# Altium schematic sheet ADC.SchDoc: ADC
size A3; Author: M.Beldyga; CompanyName: WUT ISE; DrawnBy: M.Beldyga; Organization: WUT ISE; Address1: PW ISE; Address2: Nowowiejska 15/19 00-665 Warsaw; Address3: micbeldyga@gmail.com; SheetNumber: 3; SheetTotal: 4; ModifiedBy: -; CheckedDate: -; Title2: MODULIQ; DivGrp: WUT ISE; Designer: M.Beldyga; ModifiedDate: -; ProjectName: Sensor Box
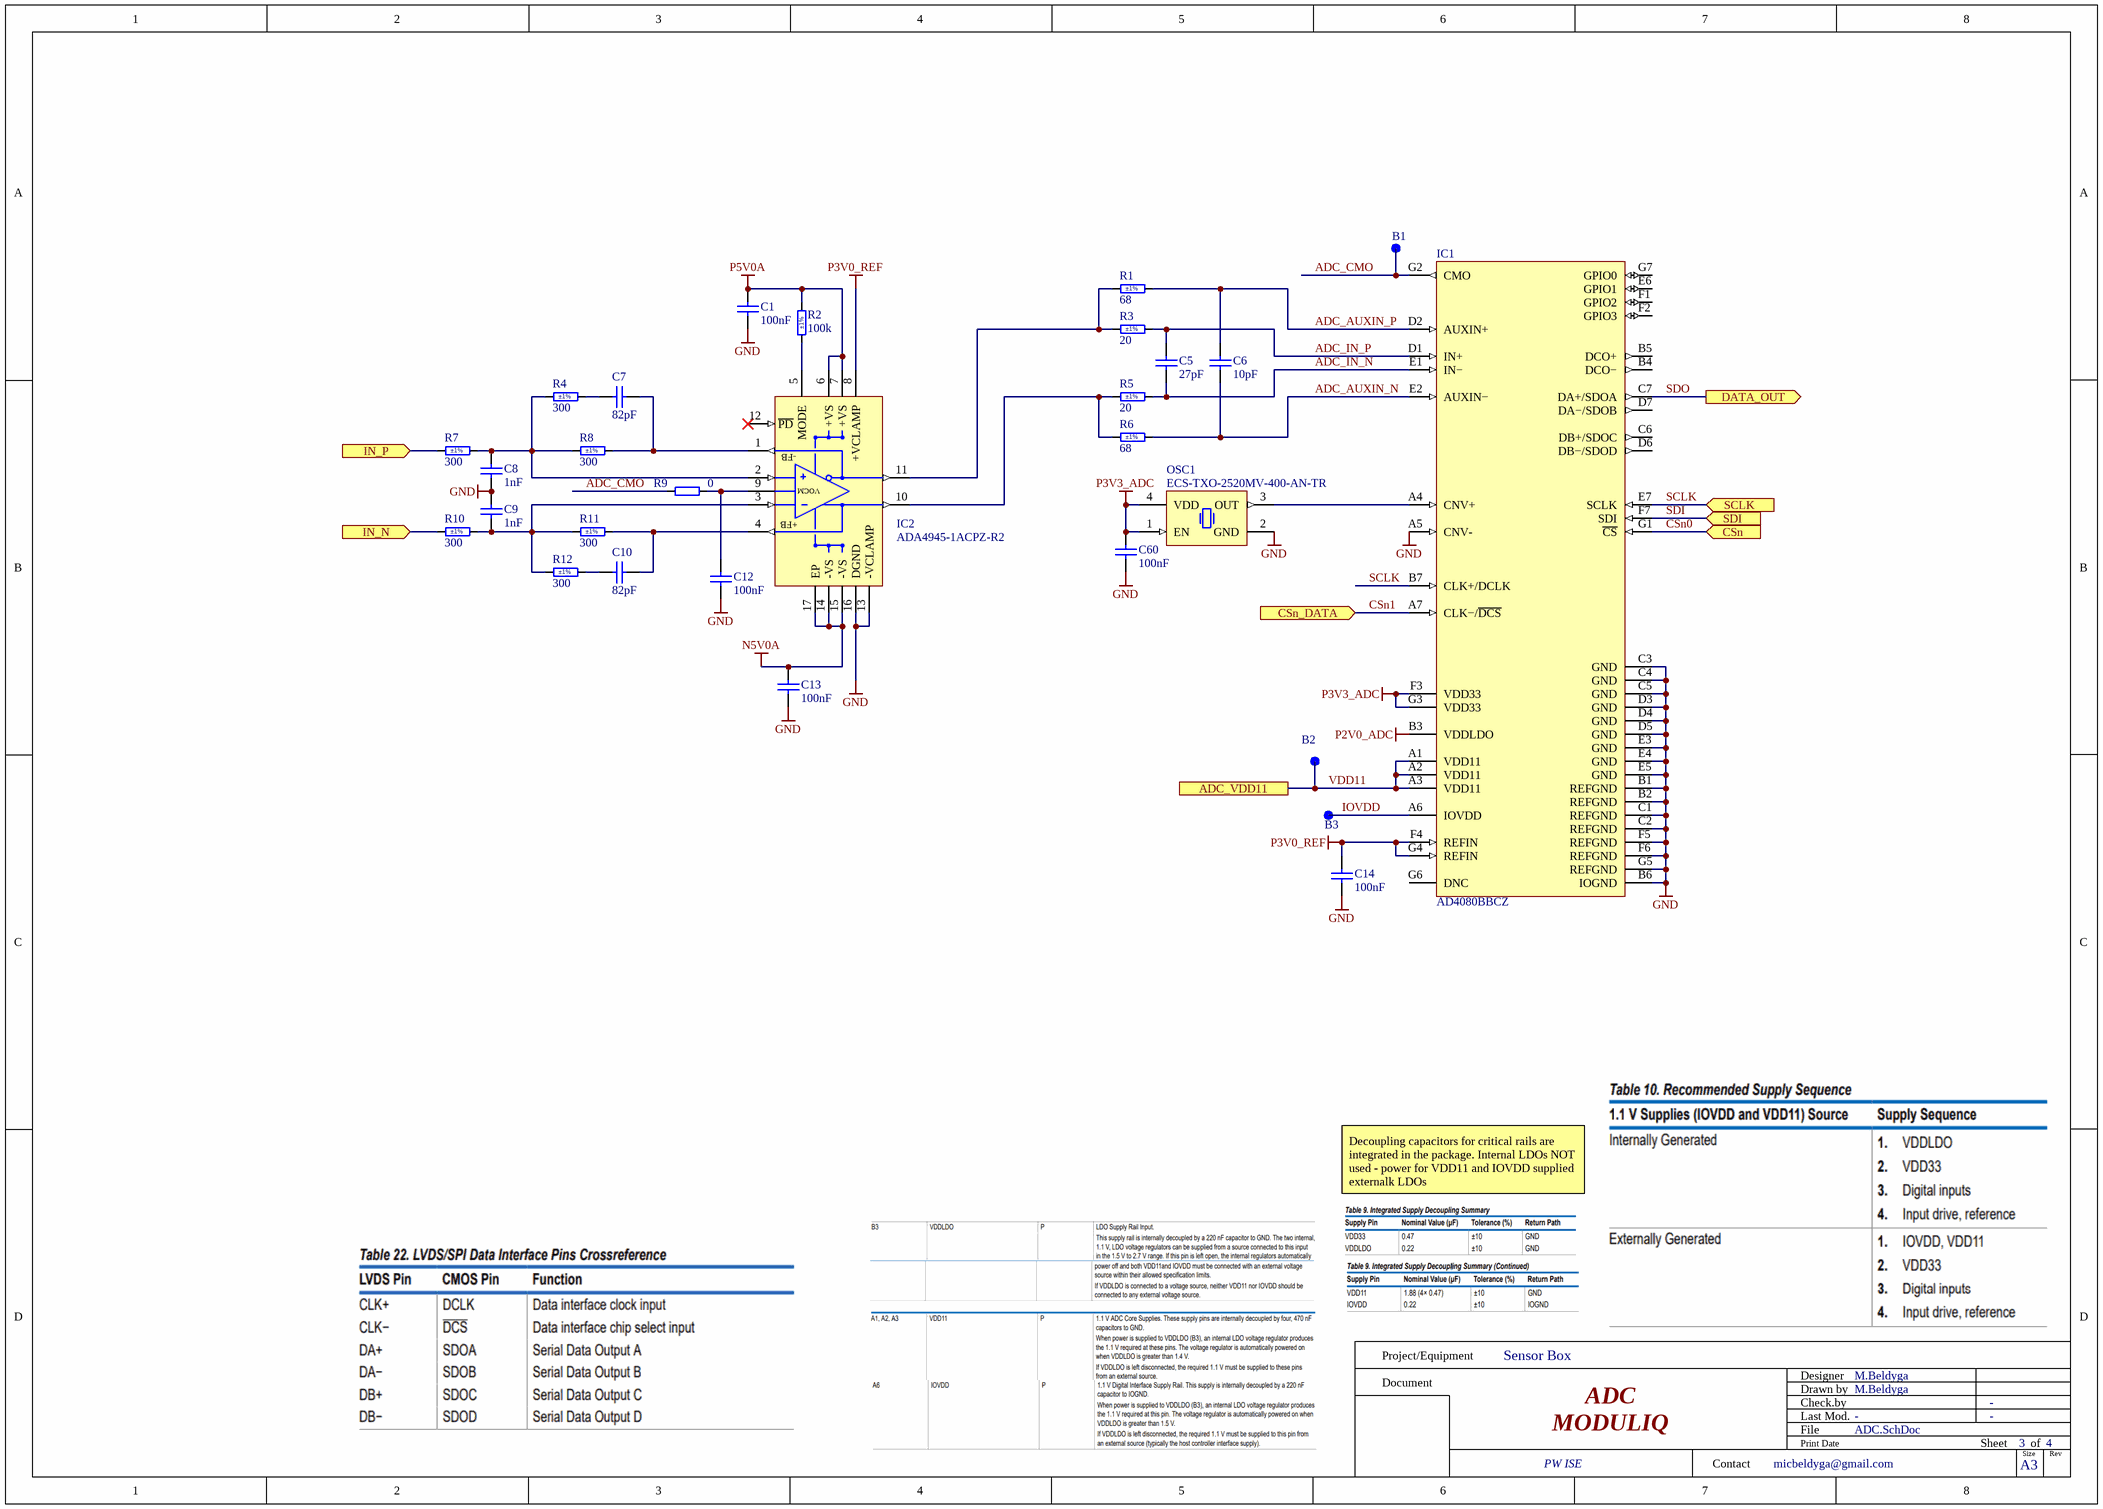
[diagram p0: ADC.SchDoc]

## Parts
B1  SMD Pad  [C100]  (value not drawn)  (no BOM)
B2  SMD Pad  [C100]  (value not drawn)  (no BOM)
B3  SMD Pad  [C100]  (value not drawn)  (no BOM)
C1  100nF  [CAPC1005X55N]
C5  27pF  [CAPC1005X55N]
C6  10pF  [CAPC1005X55N]
C7  82pF  [CAPC1005X55N]
C8  1nF  [CAPC1005X55N]
C9  1nF  [CAPC1005X55N]
C10  82pF  [CAPC1005X55N]
C12  100nF  [CAPC1005X55N]
C13  100nF  [CAPC1005X55N]
C14  100nF  [CAPC1005X55N]
C60  100nF  [CAPC1005X55N]
IC1  AD4080BBCZ  [BGA49C65P7X7_500X500X138]
IC2  ADA4945-1ACPZ-R2  [QFN50P300X300X80_HS-17N]
OSC1  ECS-TXO-2520MV-400-AN-TR  [OSC_QANTEK_QX2]
R1  68  Tolerance: ±1%  [RESC1005X40N]
R2  100k  Tolerance: ±1%  [RESC1005X40N]
R3  20  Tolerance: ±1%  [RESC1005X40N]
R4  300  Tolerance: ±1%  [RESC1005X40N]
R5  20  Tolerance: ±1%  [RESC1005X40N]
R6  68  Tolerance: ±1%  [RESC1005X40N]
R7  300  Tolerance: ±1%  [RESC1005X40N]
R8  300  Tolerance: ±1%  [RESC1005X40N]
R9  0  [RESC1005X40N]
R10  300  Tolerance: ±1%  [RESC1005X40N]
R11  300  Tolerance: ±1%  [RESC1005X40N]
R12  300  Tolerance: ±1%  [RESC1005X40N]

## Ports
ADC_VDD11, CSn (in), CSn_DATA (in), DATA_OUT (out), IN_N (in), IN_P (in), SCLK (in), SDI (in)

## Nets
GND: C1.1 C8.1 C9.2 C12.1 C13.1 C14.1 C60.1 IC1.A5(CNV-) IC1.B1(REFGND) IC1.B2(REFGND) IC1.B6(IOGND) IC1.C1(REFGND) IC1.C2(REFGND) IC1.C3(GND) IC1.C4(GND) IC1.C5(GND) IC1.D3(GND) IC1.D4(GND) IC1.D5(GND) IC1.E3(GND) IC1.E4(GND) IC1.E5(GND) IC1.F5(REFGND) IC1.F6(REFGND) IC1.G5(REFGND) IC2.13(-VCLAMP) IC2.16(DGND) OSC1.2(GND)
N5V0A: C13.2 IC2.14(-VS) IC2.15(-VS) IC2.17(EP)
P2V0_ADC: IC1.B3(VDDLDO)
P3V0_REF: C14.2 IC1.F4(REFIN) IC1.G4(REFIN) IC2.8(+VCLAMP)
P3V3_ADC: C60.2 IC1.F3(VDD33) IC1.G3(VDD33) OSC1.1(EN) OSC1.4(VDD)
P5V0A: C1.2 IC2.6(+VS) IC2.7(+VS) R2.2
ADC_AUXIN_N: C6.1 IC1.E2(AUXIN−) R6.2
ADC_AUXIN_P: C6.2 IC1.D2(AUXIN+) R1.2
ADC_CMO: B1.1 IC1.G2(CMO) R9.1
ADC_IN_N: C5.1 IC1.E1(IN−) R5.2
ADC_IN_P: C5.2 IC1.D1(IN+) R3.2
CSn0: IC1.G1(~{CS}) ; port CSn
CSn1: IC1.A7(CLK−/~{DCS}) ; port CSn_DATA
IN_N: R10.1 ; port IN_N
IN_P: R7.1 ; port IN_P
IOVDD: B3.1 IC1.A6(IOVDD)
SCLK: IC1.B7(CLK+/DCLK) IC1.E7(SCLK) ; port SCLK
SDI: IC1.F7(SDI) ; port SDI
SDO: IC1.C7(DA+/SDOA) ; port DATA_OUT
VDD11: B2.1 IC1.A1(VDD11) IC1.A2(VDD11) IC1.A3(VDD11) ; port ADC_VDD11
NetC7_1: C7.1 R4.2
NetC7_2: C7.2 IC2.1(-FB) R8.2
NetC8_2: C8.2 IC2.2(+IN) R4.1 R7.2 R8.1
NetC9_1: C9.1 IC2.3(-IN) R10.2 R11.1 R12.1
NetC10_1: C10.1 R12.2
NetC10_2: C10.2 IC2.4(+FB) R11.2
NetC12_2: C12.2 IC2.9(VOCM) R9.2
NetIC1_A4: IC1.A4(CNV+) OSC1.3(OUT)
NetIC2_5: IC2.5(MODE) R2.1
NetIC2_10: IC2.10(+OUT) R5.1 R6.1
NetIC2_11: IC2.11(-OUT) R1.1 R3.1

Not connected (* = marked no-connect by the designer): IC1 B4(DCO−) B5(DCO+) C6(DB+/SDOC) D6(DB−/SDOD) D7(DA−/SDOB) E6(GPIO1) F1(GPIO2) F2(GPIO3) G6(DNC) G7(GPIO0); IC2 12(~{PD})*

## Notes on the sheet
- Decoupling capacitors for critical rails are integrated in the package. Internal LDOs NOT used - power for VDD11 and IOVDD supplied externalk LDOs
- Project/Equipment
- Document
- Designer
- Drawn by
- Check.by
- Contact
- File
- Last Mod.
- Print Date
- Sheet
- Size
- A3
- of
- Rev

## Library data of the parts
B1-B3 = SMD_PAD_D1MM: Pad; Part Description: 1mm Diameter SMD Pad; Mounted: No; Part Number: SMD_PAD_D1MM; Component Type: Standard (No BOM); Pin Count: 1; Family: SMD Pad; Socket: No; SMD: Yes; Sense: No; Status: None; ComponentHeight: 0mm; HelpURL: Undefined; Author: CERN DEM JLC; CreateDate: 10/10/2017; LatestRevisionDate: 10/10/2017; PackageDescription: 1mm Diameter SMD Pad
C1 C12-C14 C60 = CC0402_100NF_50V_10%_X7R: Non-polarised capacitor; Part Description: SMD Multilayer Chip Ceramic Capacitor; Manufacturer: GENERIC; Manufacturer1 Part Number: GRM155R71H104KE14D; Voltage: 50V; TC: X7R; Tolerance: ±10%; Part Number: CC0402_100NF_50V_10%_X7R; Component Kind: Standard; Component Type: Standard; Pin Count: 2; Value: 100nF; Status: None; Manufacturer Part Number: CC0402_100NF_50V_10%_X7R; Case: 0402; Mounted: Yes; Socket: No; SMD: Yes; Sense: No; Manufacturer1 Example: MURATA; Manufacturer1 ComponentHeight: 0.55mm; HelpURL: \\cern.ch\dfs\Applications\Altium\Datasheets\CC0402_MURATA_GRM155R71H104KE14D.pdf; Author: CERN DEM MR; CreateDate: 6/30/2017; LatestRevisionDate: 6/30/2017
C5 = CC0402_27PF_50V_5%_C0G: Non-polarised capacitor; Part Description: SMD Multilayer Chip Ceramic Capacitor; Manufacturer: GENERIC; Manufacturer1 Part Number: C0402C270J5GACTU; Voltage: 50V; TC: C0G/NP0; Tolerance: ±5%; Part Number: CC0402_27PF_50V_5%_C0G; Component Kind: Standard; Component Type: Standard; Pin Count: 2; Value: 27pF; Status: Preferred; Manufacturer Part Number: CC0402_27PF_50V_5%_C0G; Case: 0402; Mounted: Yes; Socket: No; SMD: Yes; Sense: No; Manufacturer1 Example: KEMET; Manufacturer1 ComponentHeight: 0.55mm; HelpURL: \\cern.ch\dfs\Applications\Altium\Datasheets\CC0402_C0G_KEMET_(Commercial Grade).pdf; Author: CERN DEM JLC; CreateDate: 10/25/2012; LatestRevisionDate: 4/22/2015
C6 = CC0402_10PF_50V_5%_C0G: Non-polarised capacitor; Part Description: SMD Multilayer Chip Ceramic Capacitor; Manufacturer: GENERIC; Manufacturer1 Part Number: C0402C100J5GACTU; Voltage: 50V; TC: C0G/NP0; Tolerance: ±5%; Part Number: CC0402_10PF_50V_5%_C0G; Component Kind: Standard; Component Type: Standard; Pin Count: 2; Value: 10pF; Status: Preferred; Manufacturer Part Number: CC0402_10PF_50V_5%_C0G; Case: 0402; Mounted: Yes; Socket: No; SMD: Yes; Sense: No; Manufacturer1 Example: KEMET; Manufacturer1 ComponentHeight: 0.55mm; HelpURL: \\cern.ch\dfs\Applications\Altium\Datasheets\CC0402_C0G_KEMET_(Commercial Grade).pdf; Author: CERN DEM JLC; CreateDate: 12/3/2007; LatestRevisionDate: 4/22/2015
C7 C10 = CC0402_82PF_25V_1%_C0G_KEMET_HiQ-CBR: Non-polarised capacitor; Part Description: High Q and low ESR, SMD Multilayer Chip Ceramic Capacitor, HiQ-CBR Series; Manufacturer: KEMET; Manufacturer Part Number: CBR04C820F3GAC; Voltage: 25V; TC: C0G/NP0; Tolerance: ±1%; Part Number: CC0402_82PF_25V_1%_C0G_KEMET_HiQ-CBR; Component Kind: Standard; Component Type: Standard; Pin Count: 2; Value: 82pF; Status: Not Recommended; Case: 0402; Mounted: Yes; Socket: No; SMD: Yes; Sense: No; ComponentHeight: 0.55mm; HelpURL: \\cern.ch\dfs\Applications\Altium\Datasheets\CC0402_C0G_KEMET_HiQ-CBR.pdf; Author: CERN DEM MR; CreateDate: 11/17/2017; LatestRevisionDate: 11/21/2017
C8 C9 = CC0402_1NF_50V_5%_C0G: Non-polarised capacitor; Part Description: SMD Multilayer Chip Ceramic Capacitor; Manufacturer: GENERIC; Manufacturer1 Part Number: C0402C102J5GACTU; Voltage: 50V; TC: C0G/NP0; Tolerance: ±5%; Part Number: CC0402_1NF_50V_5%_C0G; Component Kind: Standard; Component Type: Standard; Pin Count: 2; Value: 1nF; Status: Preferred; Manufacturer Part Number: CC0402_1NF_50V_5%_C0G; Case: 0402; Mounted: Yes; Socket: No; SMD: Yes; Sense: No; Manufacturer1 Example: KEMET; Manufacturer1 ComponentHeight: 0.55mm; HelpURL: \\cern.ch\dfs\Applications\Altium\Datasheets\CC0402_C0G_KEMET_(Commercial Grade).pdf; Author: CERN DEM BC; CreateDate: 9/2/2019; LatestRevisionDate: 9/2/2019
IC1 = AD4080BBCZ: 20-Bit, 40 MSPS, Differential SAR ADC; Manufacturer: Analog Devices; Part Number: AD4080BBCZ; Component Kind: Standard; Component Type: Standard; Device: AD4080BBCZ; PackageDescription: BGA, 49-Leads, Body 5.00x5.00mmx1.38mm, Pitch 0.65mm; Part Description: 20-Bit, 40 MSPS, Differential SAR ADC; Manufacturer Part Number: AD4080BBCZ; Pin Count: 49; Case: BGA; Status: Active; Author: Michal Beldyga; CreateDate: 1/31/2025; LastRevision: 1/31/2025
IC2 = ADA4945-1ACPZ-R2: High Speed, ±0.1 µV/˚C Offset Drift, Fully Differential ADC Driver; Manufacturer: Analog Devices; Part Number: ADA4945-1ACPZ-R2; Component Kind: Standard; Component Type: Standard; Device: ADA4945-1ACPZ-R2; PackageDescription: QFN, 16-Leads, Body 3.00x3.00mm, Pitch 0.50mm, Thermal Pad 1.60x1.60mm, IPC Medium Density; Part Description: High Speed, ±0.1 µV/˚C Offset Drift, Fully Differential ADC Driver; Manufacturer Part Number: ADA4945-1ACPZ-R2; Pin Count: 17; Case: QFN; Status: Active; Author: Michal Beldyga; CreateDate: 1/31/2025; LastRevision: 1/31/2025
OSC1 = ECS-TXO-2520MV-400-AN-TR: Oscillator TCXO 40MHz ±1.5ppm (Tol) ±2.5ppm (Stability) 15pF HCMOS 55% 1.8V/2.5V/3.3V 4-Pin CSMD T/R; Manufacturer: ECS International; Body Material: Ceramic; Fall Time: 5ns; Max Supply Current: 6mA; Max Supply Voltage: 3.6V; Min Supply Voltage: 1.7V; Supplier: DigiKey; Supplier Part Number: 50-ECS-TXO-2520MV-400-AN-CT-ND; Manufacturer Part Number: ECS-TXO-2520MV-400-AN-TR; RoHS: Compliant; Category: Controlled Oscillators; Stock: 123; Pricing: 1=2.85, 10=2.48, 25=2.3452, 50=2.2482, 100=2.1551, 250=2.03816, 500=1.989, 1000=1.87335, 2000=1.86204 (USD); Frequency: 40MHz; Frequency Stability: 2.5ppm; Lifecycle Status: Production; Load Capacitance: 15pF; Max Operating Temperature: 85°C; Min Operating Temperature: -40°C; Mounting Technology: Surface Mount; Number of Terminals: 4; REACH SVHC: Yes; Rise Time: 5ns; ComponentLink1URL: https://datasheet.octopart.com:443/ECS-TXO-2520MV-400-AN-TR-ECS-International-datasheet-164298201.pdf?src-supplier=IHS; ComponentLink1Description: https://datasheet.octopart.com:443/ECS-TXO-2520MV-400-AN-TR-ECS-International-datasheet-164298201.pdf?src-supplier=IHS
R1 R6 = R0402_68R_1%_0.0625W_100PPM: Resistor - 1%; Part Description: General Purpose Thick Film Chip Resistor; Manufacturer: GENERIC; Manufacturer1 Part Number: 232270676809L; TC: ±100ppm/°C; PressFit: No; Part Number: R0402_68R_1%_0.0625W_100PPM; Component Kind: Standard; Component Type: Standard; Pin Count: 2; Value: 68; Status: Not Recommended; Power: 0.0625W; Manufacturer Part Number: R0402_68R_1%_0.0625W_100PPM; Case: 0402; Mounted: Yes; Sense: No; Socket: No; SMD: Yes; Manufacturer1 Example: YAGEO PHYCOMP; Manufacturer1 ComponentHeight: 0.4mm; HelpURL: \\cern.ch\dfs\Applications\Altium\Datasheets\R0402_Phycomp_RC0402.pdf; Author: CERN DEM JLC; CreateDate: 12/3/2007; LatestRevisionDate: 10/17/2012
R2 = R0402_100K_1%_0.0625W_100PPM: Resistor - 1%; Part Description: General Purpose Thick Film Chip Resistor; Manufacturer: GENERIC; Manufacturer1 Part Number: 232270671004L; TC: ±100ppm/°C; PressFit: No; Part Number: R0402_100K_1%_0.0625W_100PPM; Component Kind: Standard; Component Type: Standard; Pin Count: 2; Value: 100k; Status: Not Recommended; Power: 0.0625W; Manufacturer Part Number: R0402_100K_1%_0.0625W_100PPM; Case: 0402; Mounted: Yes; Sense: No; Socket: No; SMD: Yes; Manufacturer1 Example: YAGEO PHYCOMP; Manufacturer1 ComponentHeight: 0.4mm; HelpURL: \\cern.ch\dfs\Applications\Altium\Datasheets\R0402_Phycomp_RC0402.pdf; Author: CERN DEM JLC; CreateDate: 12/3/2007; LatestRevisionDate: 10/17/2012
R3 R5 = R0402_20R_1%_0.0625W_100PPM: Resistor - 1%; Part Description: General Purpose Thick Film Chip Resistor; Manufacturer: GENERIC; Manufacturer1 Part Number: 232270672009L; TC: ±100ppm/°C; PressFit: No; Part Number: R0402_20R_1%_0.0625W_100PPM; Component Kind: Standard; Component Type: Standard; Pin Count: 2; Value: 20; Status: Not Recommended; Power: 0.0625W; Manufacturer Part Number: R0402_20R_1%_0.0625W_100PPM; Case: 0402; Mounted: Yes; Sense: No; Socket: No; SMD: Yes; Manufacturer1 Example: YAGEO PHYCOMP; Manufacturer1 ComponentHeight: 0.4mm; HelpURL: \\cern.ch\dfs\Applications\Altium\Datasheets\R0402_Phycomp_RC0402.pdf; Author: CERN DEM JLC; CreateDate: 12/3/2007; LatestRevisionDate: 10/17/2012
R4 R7 R8 R10-R12 = R0402_300R_1%_0.0625W_100PPM: Resistor - 1%; Part Description: General Purpose Thick Film Chip Resistor; Manufacturer: GENERIC; Manufacturer1 Part Number: 232270673001L; TC: ±100ppm/°C; PressFit: No; Part Number: R0402_300R_1%_0.0625W_100PPM; Component Kind: Standard; Component Type: Standard; Pin Count: 2; Value: 300; Status: Not Recommended; Power: 0.0625W; Manufacturer Part Number: R0402_300R_1%_0.0625W_100PPM; Case: 0402; Mounted: Yes; Sense: No; Socket: No; SMD: Yes; Manufacturer1 Example: YAGEO PHYCOMP; Manufacturer1 ComponentHeight: 0.4mm; HelpURL: \\cern.ch\dfs\Applications\Altium\Datasheets\R0402_Phycomp_RC0402.pdf; Author: CERN DEM JLC; CreateDate: 12/3/2007; LatestRevisionDate: 10/17/2012
R9 = R0402_0R_JUMPER: Resistor; Part Description: 1A (0.05R Max DC Resistance) Zero Ohm Jumper; Manufacturer: GENERIC; Manufacturer1 Part Number: 232270591001L; PressFit: No; Part Number: R0402_0R_JUMPER; Component Kind: Standard; Component Type: Standard; Pin Count: 2; Value: 0; Status: Not Recommended; Manufacturer Part Number: R0402_0R_JUMPER; Case: 0402; Mounted: Yes; Sense: No; Socket: No; SMD: Yes; Manufacturer1 Example: YAGEO PHYCOMP; Manufacturer1 ComponentHeight: 0.4mm; HelpURL: \\cern.ch\dfs\Applications\Altium\Datasheets\R0402_Phycomp_RC0402.pdf; Author: CERN DEM JLC; CreateDate: 12/3/2007; LatestRevisionDate: 10/17/2012